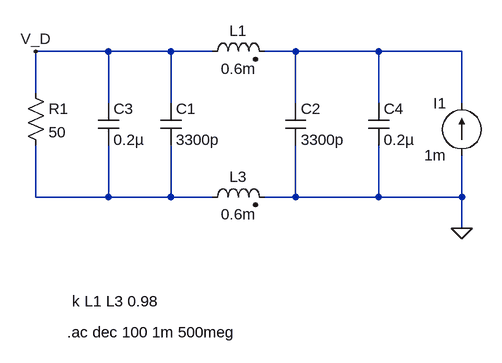
[diagram p0: schematic HW4_Q2_b_enrique_antunano.asc]
HW4_Q2_b_enrique_antunano.asc, the LTspice schematic file:
Version 4
SHEET 1 880 720
WIRE 208 272 96 272
WIRE 304 272 208 272
WIRE 368 272 304 272
WIRE 496 272 448 272
WIRE 624 272 496 272
WIRE 752 272 624 272
WIRE 96 336 96 272
WIRE 208 352 208 272
WIRE 304 352 304 272
WIRE 496 352 496 272
WIRE 624 352 624 272
WIRE 752 352 752 272
WIRE 96 496 96 416
WIRE 208 496 208 416
WIRE 208 496 96 496
WIRE 304 496 304 416
WIRE 304 496 208 496
WIRE 368 496 304 496
WIRE 496 496 496 416
WIRE 496 496 448 496
WIRE 624 496 624 416
WIRE 624 496 496 496
WIRE 752 496 752 432
WIRE 752 496 624 496
WIRE 752 544 752 496
FLAG 96 272 V_D
FLAG 752 544 0
SYMBOL ind2 352 288 R270
WINDOW 0 32 56 VTop 2
WINDOW 3 5 56 VBottom 2
SYMATTR InstName L1
SYMATTR Value 0.6m
SYMATTR Type ind
SYMBOL Cap 288 352 R0
SYMATTR InstName C1
SYMATTR Value 3300p
SYMBOL Cap 480 352 R0
SYMATTR InstName C2
SYMATTR Value 3300p
SYMBOL Res 80 320 R0
SYMATTR InstName R1
SYMATTR Value 50
SYMBOL ind2 352 512 R270
WINDOW 0 32 56 VTop 2
WINDOW 3 5 56 VBottom 2
SYMATTR InstName L3
SYMATTR Value 0.6m
SYMATTR Type ind
SYMBOL current 752 432 R180
WINDOW 0 24 80 Left 2
WINDOW 3 24 0 Left 2
SYMATTR InstName I1
SYMATTR Value 1m
SYMATTR Value2 AC 1m 0
SYMBOL Cap 192 352 R0
SYMATTR InstName C3
SYMATTR Value 0.2µ
SYMBOL Cap 608 352 R0
SYMATTR InstName C4
SYMATTR Value 0.2µ
TEXT 152 656 Left 2 !k L1 L3 0.98
TEXT 144 704 Left 2 !.ac dec 100 1m 500meg

The netlist it stands for:
* HW4_Q2_b_enrique_antunano.asc
L1 V_D N001 0.6m
C1 V_D N002 3300p
C2 N001 0 3300p
R1 V_D N002 50
L3 N002 0 0.6m
I1 0 N001 1m AC 1m 0
C3 V_D N002 0.2µ
C4 N001 0 0.2µ
k L1 L3 0.98
.ac dec 100 1m 500meg
.backanno
.end